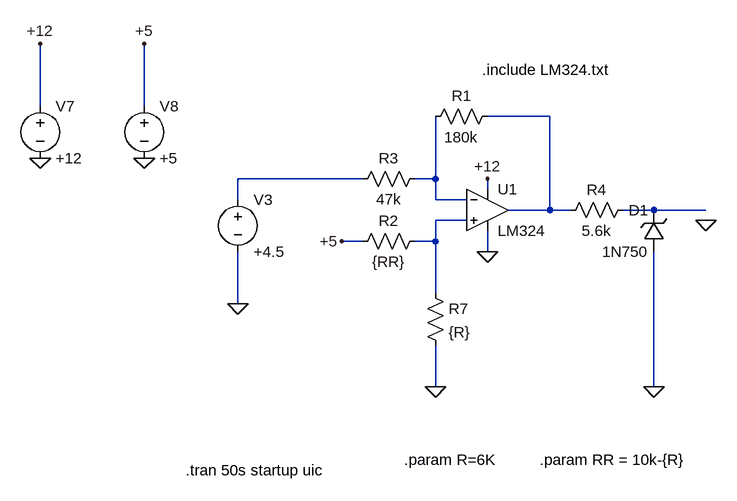
[diagram p0: schematic op.asc]
op.asc, the LTspice schematic file:
Version 4
SHEET 1 2340 680
WIRE -144 -432 -144 -528
WIRE 16 -432 16 -528
WIRE 640 -416 544 -416
WIRE 352 -320 160 -320
WIRE 464 -320 464 -416
WIRE 464 -320 432 -320
WIRE 544 -304 544 -320
WIRE 160 -288 160 -320
WIRE 464 -288 464 -320
WIRE 512 -288 464 -288
WIRE 640 -272 640 -416
WIRE 640 -272 576 -272
WIRE 672 -272 640 -272
WIRE 800 -272 752 -272
WIRE 880 -272 800 -272
WIRE 512 -256 464 -256
WIRE 352 -224 320 -224
WIRE 464 -224 464 -256
WIRE 464 -224 432 -224
WIRE 544 -208 544 -240
WIRE 464 -144 464 -224
WIRE 160 -128 160 -208
WIRE 464 0 464 -64
WIRE 800 0 800 -208
FLAG 160 -128 0
FLAG 464 0 0
FLAG 544 -208 0
FLAG -144 -352 0
FLAG 16 -352 0
FLAG -144 -528 +12
FLAG 16 -528 +5
FLAG 544 -320 +12
FLAG 320 -224 +5
FLAG 880 -256 0
FLAG 800 0 0
SYMBOL res 448 -240 R90
WINDOW 0 0 56 VBottom 2
WINDOW 3 32 56 VTop 2
SYMATTR InstName R2
SYMATTR Value {RR}
SYMBOL res 448 -336 R90
WINDOW 0 0 56 VBottom 2
WINDOW 3 32 56 VTop 2
SYMATTR InstName R3
SYMATTR Value 47k
SYMBOL res 768 -288 R90
WINDOW 0 0 56 VBottom 2
WINDOW 3 32 56 VTop 2
SYMATTR InstName R4
SYMATTR Value 5.6k
SYMBOL res 448 -160 R0
SYMATTR InstName R7
SYMATTR Value {R}
SYMBOL voltage 160 -304 R0
WINDOW 123 0 0 Left 0
WINDOW 39 0 0 Left 0
SYMATTR InstName V3
SYMATTR Value +4.5
SYMBOL voltage -144 -448 R0
WINDOW 123 0 0 Left 0
WINDOW 39 0 0 Left 0
SYMATTR InstName V7
SYMATTR Value +12
SYMBOL voltage 16 -448 R0
WINDOW 123 0 0 Left 0
WINDOW 39 0 0 Left 0
SYMATTR InstName V8
SYMATTR Value +5
SYMBOL opamp2 544 -336 R0
SYMATTR InstName U1
SYMATTR Value LM324
SYMBOL res 560 -432 R90
WINDOW 0 0 56 VBottom 2
WINDOW 3 32 56 VTop 2
SYMATTR InstName R1
SYMATTR Value 180k
SYMBOL zener 816 -208 R180
WINDOW 0 24 64 Left 2
WINDOW 3 24 0 Left 2
SYMATTR InstName D1
SYMATTR Value 1N750
SYMATTR Description Diode
SYMATTR Type diode
TEXT 80 128 Left 2 !.tran 50s startup uic
TEXT 416 112 Left 2 !.param R=6K
TEXT 536 -488 Left 2 !.include LM324.txt
TEXT 624 112 Left 2 !.param RR = 10k-{R}

The netlist it stands for:
* op.asc
R2 N005 +5 {RR}
R3 N003 N002 47k
R4 N004 N001 5.6k
R7 N005 0 {R}
V3 N002 0 +4.5
V7 +12 0 +12
V8 +5 0 +5
XU1 N005 N003 +12 0 N001 LM324  ; pins In+ In- V+ V- OUT
R1 N001 N003 180k
D1 0 N004 1N750
.model D D
.lib standard.dio
.tran 50s startup uic
.param R=6K
.include LM324.txt
.param RR = 10k-{R}
.backanno
.end